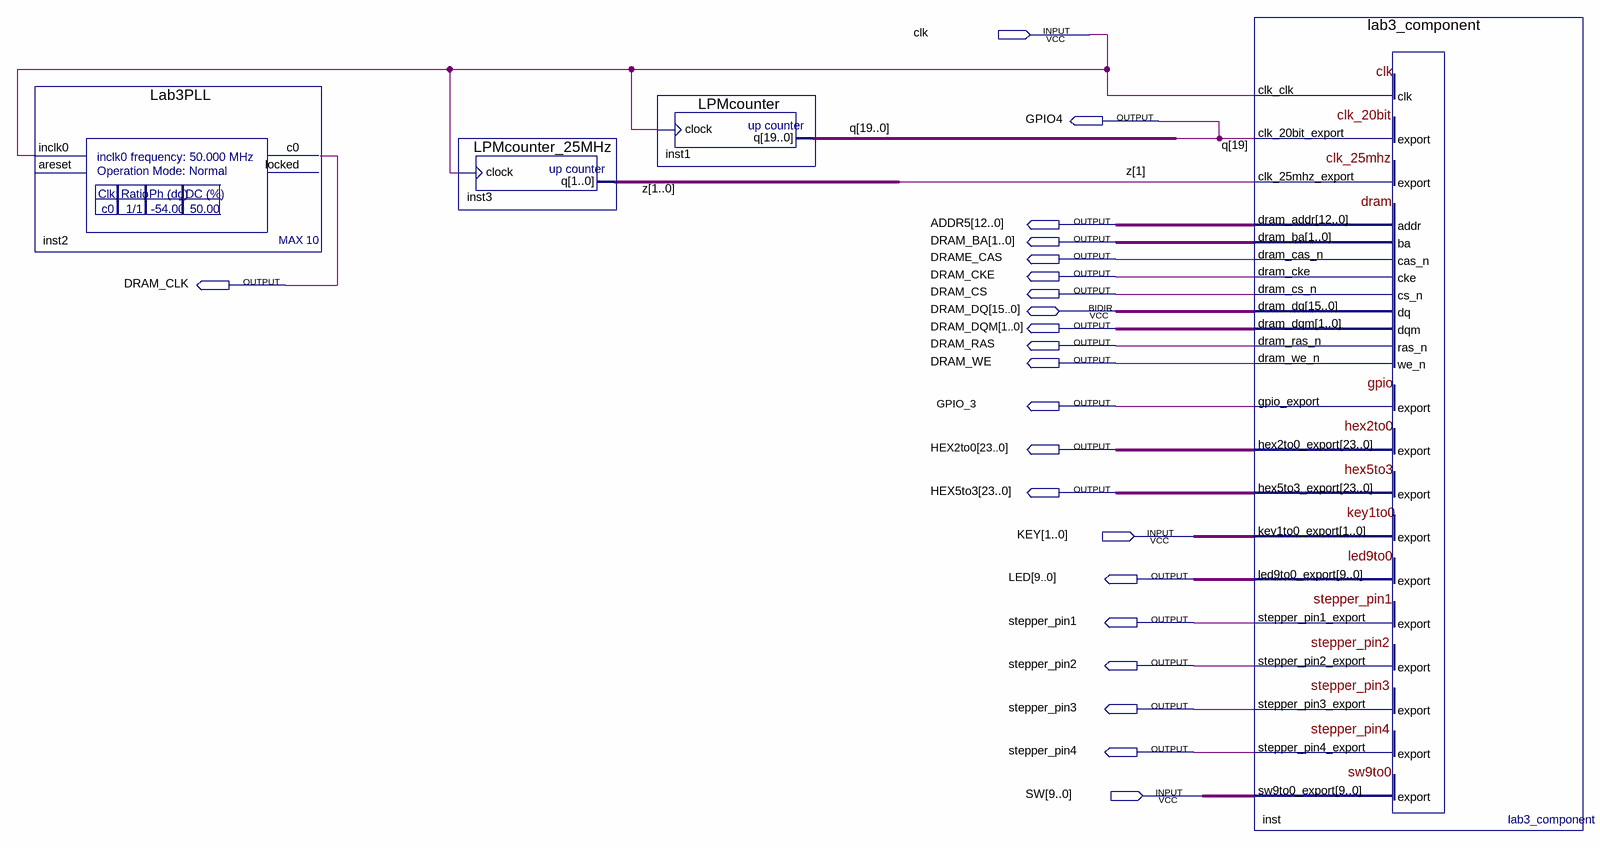
[diagram p0: schematic sheet]
// Quartus schematic Lab3.bdf as structural Verilog: 4 symbols, 22 pins
module Lab3 (
  input  clk,
  input  [1:0] KEY,
  input  [9:0] SW,
  inout  [15:0] DRAM_DQ,
  output GPIO4,
  output [12:0] ADDR5,
  output [1:0] DRAM_BA,
  output DRAME_CAS,
  output DRAM_CKE,
  output DRAM_CLK,
  output DRAM_CS,
  output [1:0] DRAM_DQM,
  output DRAM_RAS,
  output DRAM_WE,
  output GPIO_3,
  output [23:0] HEX2to0,
  output [23:0] HEX5to3,
  output [9:0] LED,
  output stepper_pin1,
  output stepper_pin2,
  output stepper_pin3,
  output stepper_pin4
);

  wire [1:0] z;
  wire [18:0] q;

  Lab3PLL inst2 (.inclk0(clk), .c0(DRAM_CLK));  // open: areset, locked
  LPMcounter_25MHz inst3 (.clock(clk), .q(z));
  LPMcounter inst1 (.clock(clk), .q({GPIO4, q}));
  lab3_component inst (
    .clk_clk(clk), .clk_20bit_export(GPIO4), .clk_25mhz_export(z[1]), .key1to0_export(KEY),
    .sw9to0_export(SW), .dram_addr(ADDR5), .dram_ba(DRAM_BA), .dram_cas_n(DRAME_CAS), .dram_cke(DRAM_CKE),
    .dram_cs_n(DRAM_CS), .dram_dqm(DRAM_DQM), .dram_ras_n(DRAM_RAS), .dram_we_n(DRAM_WE),
    .gpio_export(GPIO_3), .hex2to0_export(HEX2to0), .hex5to3_export(HEX5to3), .led9to0_export(LED),
    .stepper_pin1_export(stepper_pin1), .stepper_pin2_export(stepper_pin2),
    .stepper_pin3_export(stepper_pin3), .stepper_pin4_export(stepper_pin4), .dram_dq(DRAM_DQ));

  // Other names for the same wires on the sheet: q[19] = GPIO4
endmodule
